# Altium schematic sheet N64Connector.SchDoc
size A4
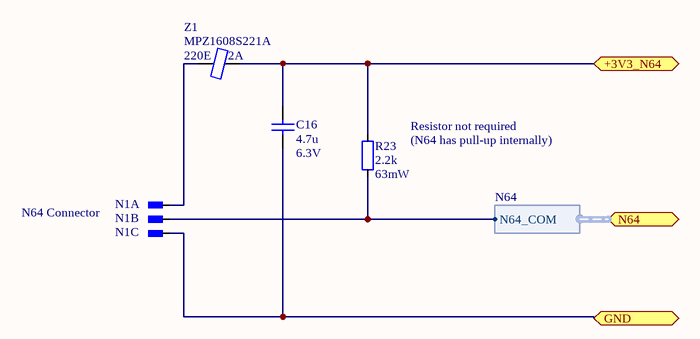
[diagram p0: N64Connector.SchDoc]

## Parts
C16  value 4.7u  Value2: 6.3V  [SMD_CAP_0603]  (hidden comment: C_SMD_CER_4U7_6V3_10%_X5R_0603)
N1  X_CONNECTOR_P2.54_D0.9_1X3  [THT_CON_P2.54_D0.9_1X3]  (value not drawn)  (parts A,B,C of 3)
R23  value 2.2k  Value2: 63mW  [SMD_RES_0402]  (hidden comment: R_SMD_THINFILM_2K2_0W063_0%5_25PPM_0402)
Z1  value 220E  Type: MPZ1608S221A  Value2: 2A  [SMD_RES_0603]  (hidden comment: Z_SMD_FERRITE_2A_220E@100MHZ_0603)

## Ports
+3V3_N64, GND, N64 (harness N64)

## Harnesses
N64: N64_COM

## Nets
+3V3_N64: C16.2 R23.2 Z1.2 ; port +3V3_N64
GND: C16.1 N1.3 ; port GND
NetN1_1: N1.1 Z1.1
NetN1_2: N1.2 R23.1 ; port N64.N64_COM

## Notes on the sheet
- (near R23) Resistor not required
- (near R23) (N64 has pull-up internally)
- N64 Connector
- Title
- Size:
- Date:
- A4
- Number:
- Time:
- Revision:
- Sheet
- of
- File:

## Library data of the parts
N1 = X_CONNECTOR_P2.54_D0.9_1X3: Pitch 2.54, Diameter 0.9mm, 1 row, 3 columns; Type: Pitch 2.54, Diameter 0.9mm, 1 row, 3 columns
R23 = R_SMD_THINFILM_2K2_0W063_0%5_25PPM_0402: 2.2 kOhms ±0.5% 0.063W, 1/16W Chip Resistor 0402 (1005 Metric) Automotive AEC-Q200 Thin Film; Supplier - Digikey: P2.2KDECT-ND
Z1 = Z_SMD_FERRITE_2A_220E@100MHZ_0603: Ferrite Beads; Supplier - E+H Flowtec AG: 50104604; Supplier - Digikey: 445-1565-1-ND
C16 = C_SMD_CER_4U7_6V3_10%_X5R_0603: Supplier - Digikey: 1276-1045-1-ND